# EAGLE design sc-pcb (EAGLE 8.4.0)
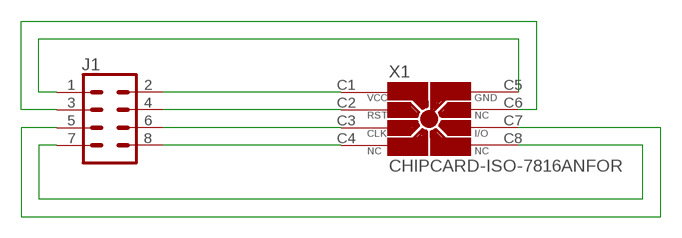
[diagram p0: schematic, sheet 1]

## Parts
J1  CONN_04X2  [2X4]
X1  CHIPCARD-ISO-7816ANFOR  [AFNOR-CHIPCARD]

## Nets
N$1: J1.8 X1.C4(NC)
N$2: J1.6 X1.C3(CLK)
N$3: J1.4 X1.C2(RST)
N$4: J1.2 X1.C1(VCC)
N$5: J1.7 X1.C8(NC)
N$6: J1.5 X1.C7(I/O)
N$7: J1.1 X1.C5(GND)
N$8: J1.3 X1.C6(NC)

## Library data of the parts
J1 = SparkFun-Connectors:CONN_04X2: Multi connection point. Often used as Generic Header-pin footprint for 0.1 inch spaced/style header connections On any of the 0.1 inch spaced packages, you can populate with these: Break Away Headers - Straight <https://www.sparkfun.com/products/116> (PRT-00116) Break Away Male Headers - Right Angle <https://www.sparkfun.com/products/553> (PRT-00553) Female Headers <https://www.sparkfun.com/products/115> (PRT-00115) Break Away Headers - Machine Pin <https://www.sparkfun.com/products/117> (PRT-00117) Break Away Female Headers - Swiss Machine Pin <https://www.sparkfun.com/products/743> (PRT-00743)
X1 = con-chipcard-iso7816:CHIPCARD-ISO-7816: Chip card connector ISO 7816; OC_FARNELL: unknown; OC_NEWARK: unknown

## Board
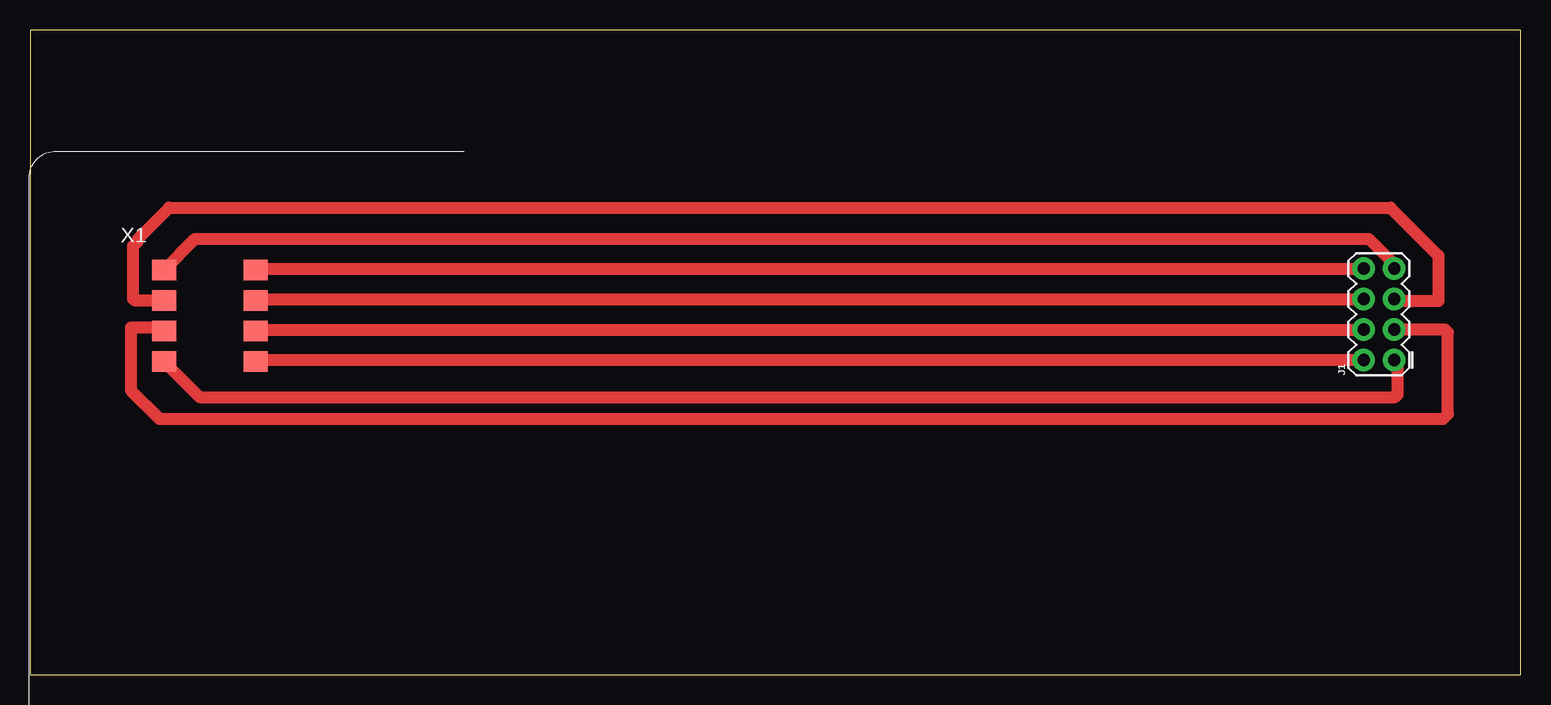
[diagram p1: board, top side]
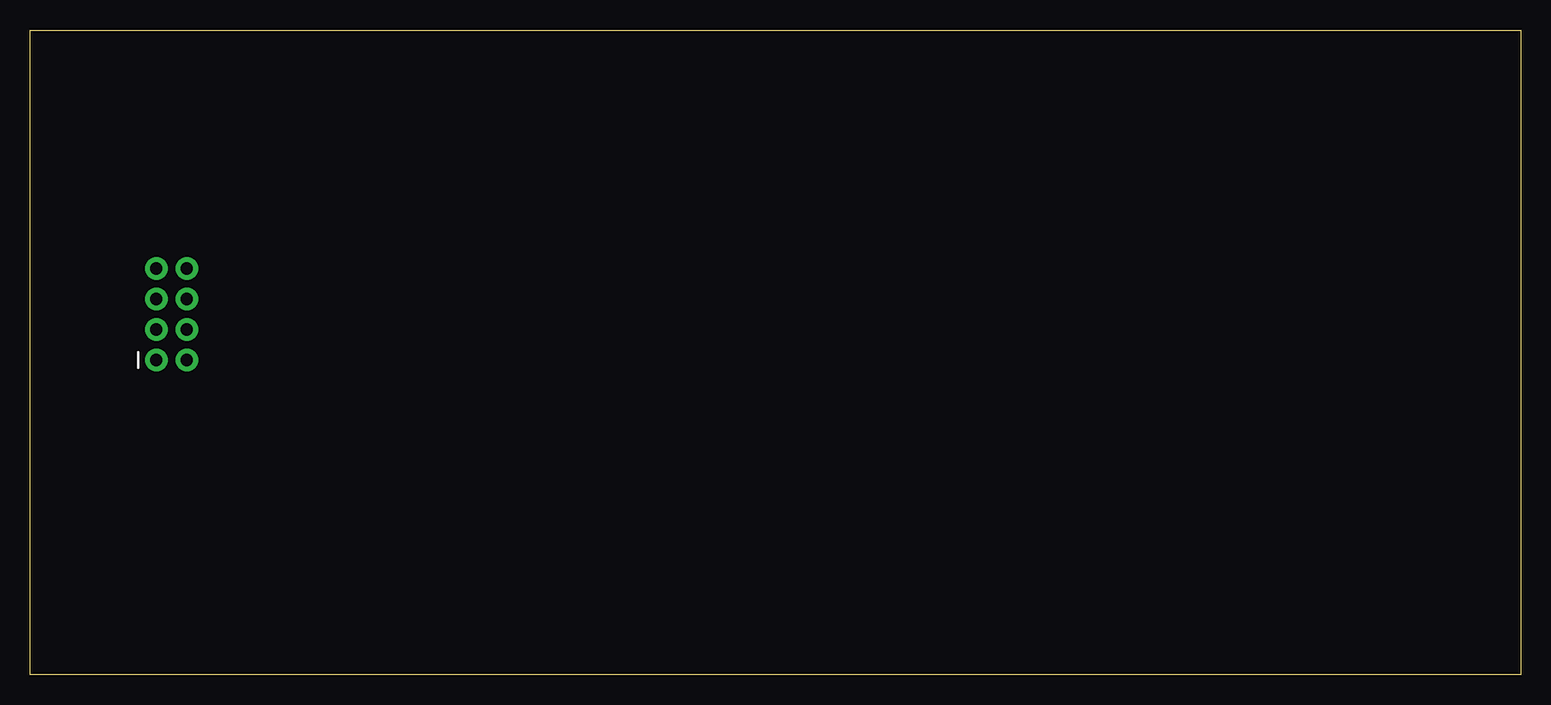
[diagram p2: board, bottom side, seen from below]

Size 124.25 x 53.74 mm. Coordinates in mm from the lower left corner, seen from the top.
Outline: 0,0 124.25,0 124.25,53.74 0,53.74 0,0
Copper layers (1*16): Top 0.035559375mm / dielectric 1.6mm / Bottom 0.035559375mm
Design rules "oshpark-2layer": minimum track width 6mil, minimum drill 10mil, track to track 6mil, track to pad 6mil, pad to pad 6mil, via to via 6mil, smd to smd 6mil, copper to edge 15mil, drill to drill 6mil, minimum pad ring 5mil, minimum via ring 5mil, stop-mask expansion 2.5mil, vias tented up to drill 0mil, thermal gap 10mil

### Footprints (pad centres in the part's own frame; a part is rotated, then mirrored left to right if it is on the bottom)
2X4 = drill 1.016 pad 1.88: 1 -3.81,-1.27; 2 -3.81,1.27; 3 -1.27,-1.27; 4 -1.27,1.27; 5 1.27,-1.27; 6 1.27,1.27; 7 3.81,-1.27; 8 3.81,1.27
AFNOR-CHIPCARD = smd 2 x 1.7: C1 18.872,-17.541; C2 18.871,-15; C3 18.868,-12.457; C4 18.871,-9.92; C5 11.251,-17.542; C6 11.252,-15; C7 11.25,-12.459; C8 11.252,-9.92

### Placement (x,y rotation side)
J1  112.45,30.05 90 top
X1  -0.08,43.65 0 top

### Tracks (layer width: path | path; a pad name or v marks a point on that pad's centre or on a via)
N$1
  Top 1.016: X1.C4 18.93,33.86 J1.8
N$2
  Top 1.016: X1.C3 18.92,31.32 J1.6
N$3
  Top 1.016: X1.C2 18.93,28.78 J1.4
N$4
  Top 1.016: X1.C1 18.93,26.24 J1.2
N$5
  Top 1.016: X1.C8 13.79,36.34 111.6,36.34 113.72,34.22 J1.7
N$6
  Top 1.016: X1.C7 8.75,31.19 8.6,31.34 8.6,35.74 9,36.14 9,36.34 11.6,38.94 113.4,38.94 117.4,34.94 117.4,31.14 113.9,31.14 J1.5
N$7
  Top 1.016: X1.C5 14.14,23.14 113.8,23.14 114,23.34 114,25.96 J1.1
N$8
  Top 1.016: X1.C6 10.88,28.94 8.4,28.94 8.4,23.74 10.8,21.34 117.8,21.34 118.2,21.74 118.2,28.54 117.96,28.78 J1.3